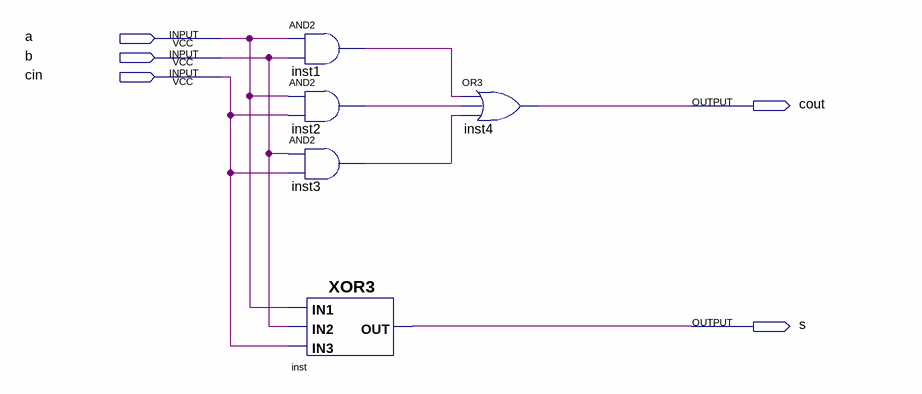
[diagram p0: schematic sheet]
// Quartus schematic fulladder.bdf as structural Verilog: 5 symbols, 5 pins
module fulladder (
  input  a,
  input  b,
  input  cin,
  output cout,
  output s
);

  wire inst1_out, inst2_out, inst3_out;

  and inst1 (inst1_out, a, b);
  and inst2 (inst2_out, a, cin);
  and inst3 (inst3_out, b, cin);
  XOR3 inst (.IN3(cin), .IN1(a), .IN2(b), .OUT(s));
  or inst4 (cout, inst1_out, inst2_out, inst3_out);
endmodule
